# Altium schematic sheet ESP32-S3-M.2_2024-03-15.schdoc
size 296 x 182 mm
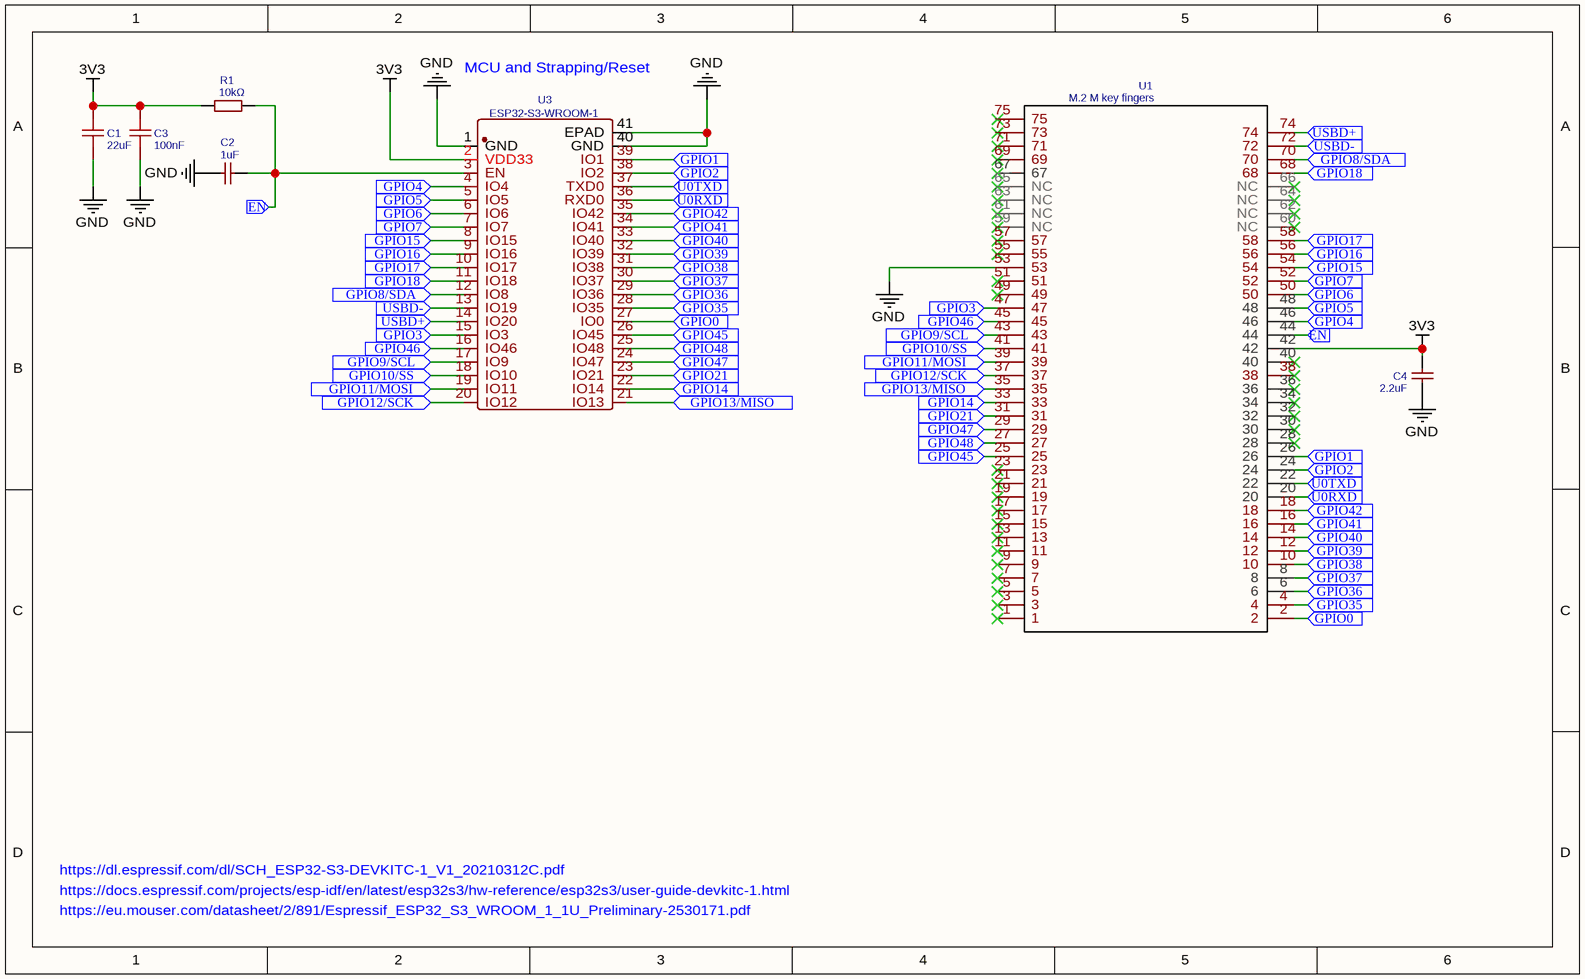
[diagram p0: ESP32-S3-M.2_2024-03-15.schdoc]

## Parts
C1  22uF  [C0603]
C2  1uF  [C0603]
C3  100nF  [C0603]
C4  2.2uF  [C0603]
R1  10kΩ  [R0603]
U1  M.2 M key fingers  [M.2 M KEY FINGERS]
U3  ESP32-S3-WROOM-1  [ESP32-S3-WROOM-1]

## Ports
EN (in), GPIO0 (in), GPIO1 (in), GPIO2 (in), GPIO3 (in), GPIO4 (in), GPIO5 (in), GPIO6 (in), GPIO7 (in), GPIO8/SDA (in), GPIO9/SCL (in), GPIO10/SS (in), GPIO11/MOSI (in), GPIO12/SCK (in), GPIO13/MISO (in), GPIO14 (in), GPIO15 (in), GPIO16 (in), GPIO17 (in), GPIO18 (in), GPIO21 (in), GPIO35 (in), GPIO36 (in), GPIO37 (in), GPIO38 (in), GPIO39 (in), GPIO40 (in), GPIO41 (in), GPIO42 (in), GPIO45 (in), GPIO46 (in), GPIO47 (in), GPIO48 (in), U0RXD (in), U0TXD (in), USBD+ (in), USBD- (in)

## Nets
3V3: C1.2 C3.2 C4.2 R1.1 U1.42 U3.2(VDD33)
GND: C1.1 C2.1 C3.1 C4.1 U1.53 U3.1(GND) U3.40(GND) U3.41(EPAD)
EN: C2.2 R1.2 U1.44 U3.3(EN) ; port EN
GPIO0: U1.2 U3.27(IO0) ; port GPIO0
GPIO1: U1.26 U3.39(IO1) ; port GPIO1
GPIO2: U1.24 U3.38(IO2) ; port GPIO2
GPIO3: U1.47 U3.15(IO3) ; port GPIO3
GPIO4: U1.46 U3.4(IO4) ; port GPIO4
GPIO5: U1.48 U3.5(IO5) ; port GPIO5
GPIO6: U1.50 U3.6(IO6) ; port GPIO6
GPIO7: U1.52 U3.7(IO7) ; port GPIO7
GPIO8/SDA: U1.70 U3.12(IO8) ; port GPIO8/SDA
GPIO9/SCL: U1.43 U3.17(IO9) ; port GPIO9/SCL
GPIO10/SS: U1.41 U3.18(IO10) ; port GPIO10/SS
GPIO11/MOSI: U1.39 U3.19(IO11) ; port GPIO11/MOSI
GPIO12/SCK: U1.37 U3.20(IO12) ; port GPIO12/SCK
GPIO13/MISO: U1.35 U3.21(IO13) ; port GPIO13/MISO
GPIO14: U1.33 U3.22(IO14) ; port GPIO14
GPIO15: U1.54 U3.8(IO15) ; port GPIO15
GPIO16: U1.56 U3.9(IO16) ; port GPIO16
GPIO17: U1.58 U3.10(IO17) ; port GPIO17
GPIO18: U1.68 U3.11(IO18) ; port GPIO18
GPIO21: U1.31 U3.23(IO21) ; port GPIO21
GPIO35: U1.4 U3.28(IO35) ; port GPIO35
GPIO36: U1.6 U3.29(IO36) ; port GPIO36
GPIO37: U1.8 U3.30(IO37) ; port GPIO37
GPIO38: U1.10 U3.31(IO38) ; port GPIO38
GPIO39: U1.12 U3.32(IO39) ; port GPIO39
GPIO40: U1.14 U3.33(IO40) ; port GPIO40
GPIO41: U1.16 U3.34(IO41) ; port GPIO41
GPIO42: U1.18 U3.35(IO42) ; port GPIO42
GPIO45: U1.25 U3.26(IO45) ; port GPIO45
GPIO46: U1.45 U3.16(IO46) ; port GPIO46
GPIO47: U1.29 U3.24(IO47) ; port GPIO47
GPIO48: U1.27 U3.25(IO48) ; port GPIO48
U0RXD: U1.20 U3.36(RXD0) ; port U0RXD
U0TXD: U1.22 U3.37(TXD0) ; port U0TXD
USBD+: U1.74 U3.14(IO20) ; port USBD+
USBD-: U1.72 U3.13(IO19) ; port USBD-

Not connected (* = marked no-connect by the designer): U1 1* 3* 5* 7* 9* 11* 13* 15* 17* 19* 21* 23* 28* 30* 32* 34* 36* 38* 40* 49* 51* 55* 57* 59(NC)* 60(NC)* 61(NC)* 62(NC)* 63(NC)* 64(NC)* 65(NC)* 66(NC)* 67* 69* 71* 73* 75*

## Notes on the sheet
- MCU and Strapping/Reset
- https://dl.espressif.com/dl/SCH_ESP32-S3-DEVKITC-1_V1_20210312C.pdf
- https://docs.espressif.com/projects/esp-idf/en/latest/esp32s3/hw-reference/esp32s3/user-guide-devkitc-1.html
- https://eu.mouser.com/datasheet/2/891/Espressif_ESP32_S3_WROOM_1_1U_Preliminary-2530171.pdf

## Library data of the parts
C1 = 22uF: Manufacturer: SAMSUNG(三星); Manufacturer Part: CL10A226MQ8NRNC; nameAlias: Capacitance; Supplier: LCSC; Supplier Part: C59461; JLCPCB Part Class: Basic Part; spicePre: C; spiceSymbolName: CL10A226MQ8NRNC
C2 = 1uF: Manufacturer Part: CL10A105KB8NNNC; Manufacturer: SAMSUNG(三星); nameAlias: Capacitance; Supplier: LCSC; Supplier Part: C15849; JLCPCB Part Class: Basic Part; spicePre: C; spiceSymbolName: CL10A105KB8NNNC
C3 = 100nF: Manufacturer: YAGEO(国巨); Manufacturer Part: CC0603KRX7R9BB104; nameAlias: Capacitance; Supplier: LCSC; Supplier Part: C14663; JLCPCB Part Class: Basic Part; spicePre: C; spiceSymbolName: CC0603KRX7R9BB104
C4 = 2.2uF: Manufacturer Part: CL10A225KP8NNNC; Manufacturer: SAMSUNG(三星); nameAlias: Value; Supplier: LCSC; Supplier Part: C1607; JLCPCB Part Class: Extended Part; link: https://lcsc.com/eda_search?q=C1607&%26type=1&ref=editor; spicePre: C; spiceSymbolName: CL10A225KP8NNNC
R1 = 10kΩ: Manufacturer: YAGEO(国巨); Manufacturer Part: RC0603FR-0710KL; nameAlias: Value; Supplier: LCSC; Supplier Part: C98220; JLCPCB Part Class: Extended Part; link: https://lcsc.com/eda_search?q=C98220&%26type=1&ref=editor; spicePre: R; spiceSymbolName: RC0603FR-0710KL
U1 = M.2 M key fingers: Contributor: Nikola Pantelin; Manufacturer Part: M.2 M key fingers; spicePre: U; spiceSymbolName: M.2 M key fingers
U3 = ESP32-S3-WROOM-1: Manufacturer: Espressif Systems; Contributor: max30012540; Manufacturer Part: ESP32-S3-WROOM-1; Supplier Part: C2913202; spicePre: U; spiceSymbolName: ESP32-S3-WROOM-1